# Altium project 3_Interface_Charge_RBF.PrjPCB
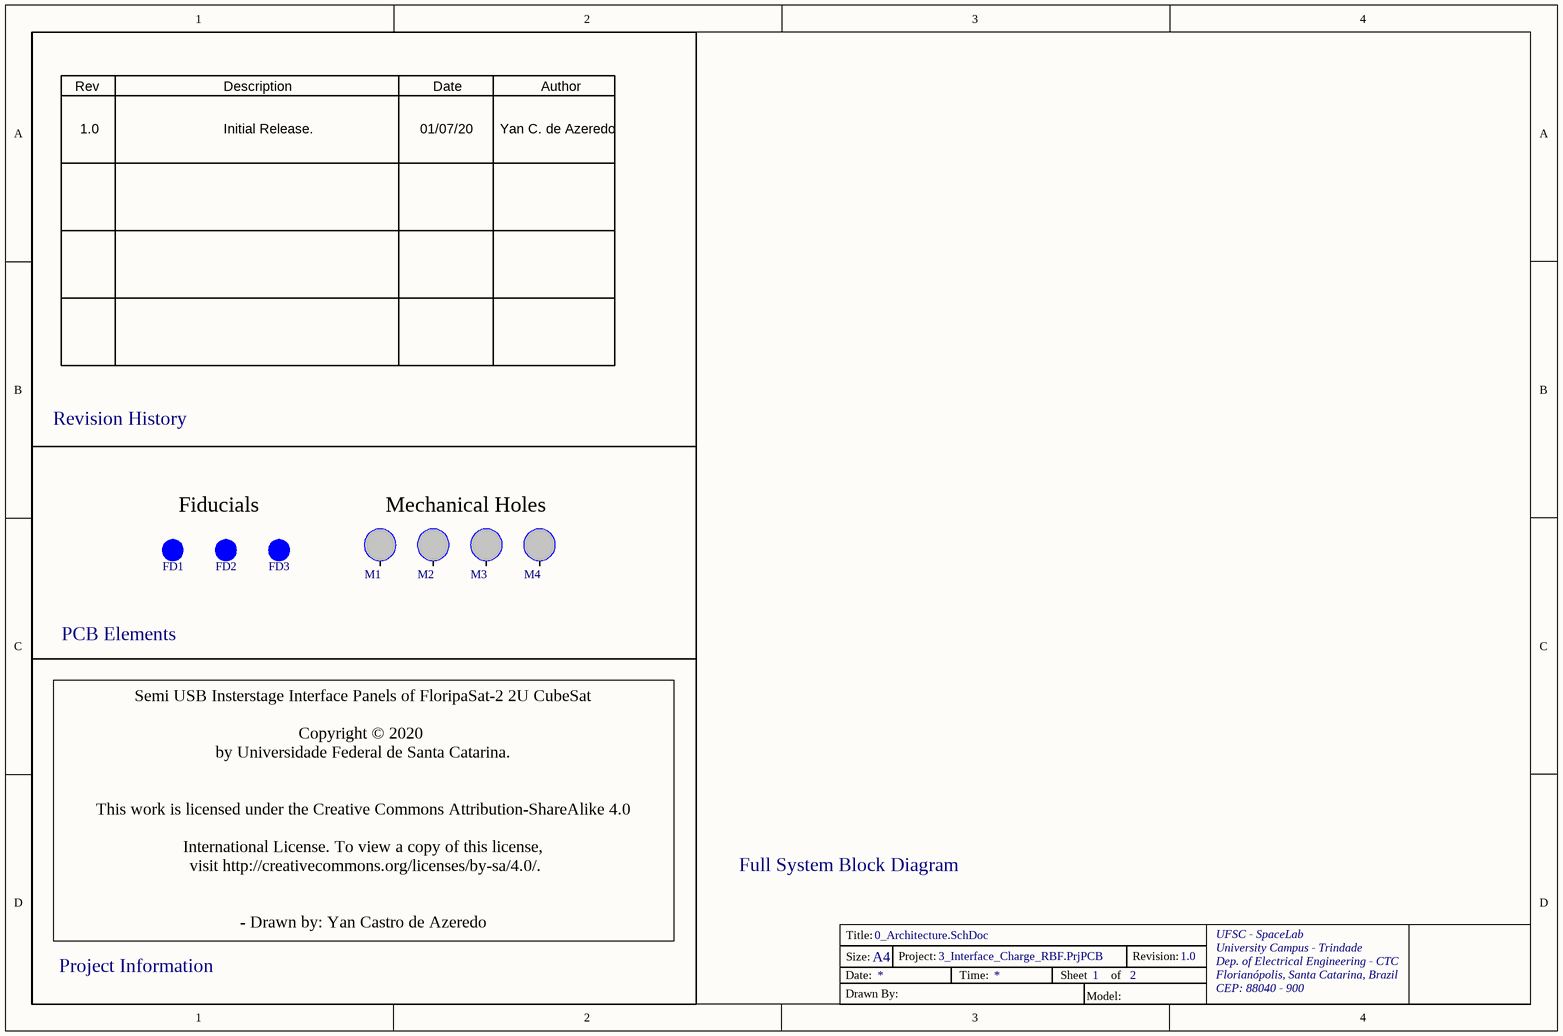
[diagram p0: 0_Architecture.SchDoc]
2 sheets, 11 parts. Net scope: global (net labels, ports and power ports of the same name join across sheets).
Board file: 3_Interface_Charge_RBF.PcbDoc
Sheets:
  0_Architecture.SchDoc
  3_Interface_Charge_RBF.SchDoc

## Sheet 0_Architecture.SchDoc
size A4; Organization: SpaceLab UFSC; Address1: UFSC - SpaceLab; Address2: University Campus - Trindade; Address3: Dep. of Electrical Engineering - CTC; Address4: Florianópolis, Santa Catarina, Brazil; DocumentNumber: 1; Revision: 1.0; SheetNumber: 1; SheetTotal: 2; Address5: CEP: 88040 - 900

### Parts
FD1  Fiducial  [Fiducial 1.3mm]  (value not drawn)  (no BOM)
FD2  Fiducial  [Fiducial 1.3mm]  (value not drawn)  (no BOM)
FD3  Fiducial  [Fiducial 1.3mm]  (value not drawn)  (no BOM)
M1  IB Mechanical Hole  [IB Mechanical Hole]  (value not drawn)  (no BOM)
M2  IB Mechanical Hole  [IB Mechanical Hole]  (value not drawn)  (no BOM)
M3  IB Mechanical Hole  [IB Mechanical Hole]  (value not drawn)  (no BOM)
M4  IB Mechanical Hole  [IB Mechanical Hole]  (value not drawn)  (no BOM)

### Nets

Not connected (* = marked no-connect by the designer): M1 0; M2 0; M3 0; M4 0

### Notes on the sheet
- Rev
- Description
- Date
- Author
- 1.0
- Initial Release.
- 01/07/20
- Yan C. de Azeredo
- Revision History
- Fiducials
- Mechanical Holes
- PCB Elements
- Full System Block Diagram
- Semi USB Insterstage Interface Panels of FloripaSat-2 2U CubeSat
  Copyright © 2020
  by Universidade Federal de Santa Catarina.
  This work is licensed under the Creative Commons Attribution-ShareAlike 4.0
  International License. To view a copy of this license,
  visit http://creativecommons.org/licenses/by-sa/4.0/.
  - Drawn by: Yan Castro de Azeredo
  - Reviewers: Gabriel M. Marcelino and André M. P. Mattos
  - Support: Gabriel M. Marcelino, André M. P. Mattos and Kleber Gouveia
  - Mechanical validation: Edemar Morsch Filho
- Project Information
- Date:
- Title:
- Size:
- A4
- Project:
- Time:
- Sheet
- of
- Revision:
- UFSC - SpaceLab
- University Campus - Trindade
- Dep. of Electrical Engineering - CTC
- Florianópolis, Santa Catarina, Brazil
- CEP: 88040 - 900
- Drawn By:
- Model:

### Library data of the parts
FD1-FD3 = Fiducial: Fiducial for DB board variants
M1-M4 = IB Mechanical Hole: Mechanical Hole for FloripaSat-2 interface boards

## Sheet 3_Interface_Charge_RBF.SchDoc
size A4
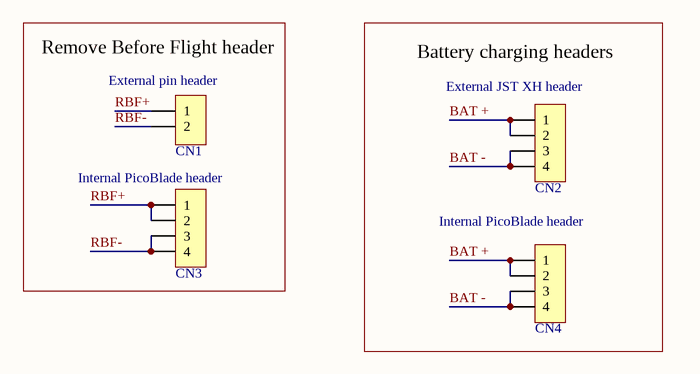
[diagram p1: 3_Interface_Charge_RBF.SchDoc]

### Parts
CN1  M20-9990245  [CONN HEADER VERT 2POS 2.54mm]  (value not drawn)
CN2  B4B-XH-A(LF)(SN)  [B4B-XH-A(LF)(SN)]  (value not drawn)
CN3  0533980471  [PICO BLADE 0533980471]  (value not drawn)
CN4  0533980471  [PICO BLADE 0533980471]  (value not drawn)

### Blocks framed on the sheet
Remove Before Flight header: CN1 CN3
Battery charging headers: CN2 CN4

### Nets
BAT +: CN2.1 CN2.2 CN4.1 CN4.2
BAT -: CN2.3 CN2.4 CN4.3 CN4.4
RBF+: CN1.1 CN3.1 CN3.2
RBF-: CN1.2 CN3.3 CN3.4

### Notes on the sheet
- (near CN1) External pin header
- (near CN2) External JST XH header
- (near CN3) Internal PicoBlade header
- Internal PicoBlade header

### Library data of the parts
CN1 = M20-9990245: M20 HDR, PIN, SIL, VERT, 2W; Manufacturer: Harwin; Number of Contacts: 2; Current Rating: 3A; Contact Resistance: 25mR; Mating Cycles: 300; Voltage Rating (AC): 750V; Insulation Resistance: 10GR; Gender: Male; Connector Type: Male Pin; Voltage: 50V; Pitch: 2.54mm; Supplier 1: Digi-Key; Supplier Part Number 1: 952-2261-ND; Stock 1: 27298; Pricing 1: 1=0.15, 10=0.136, 100=0.0841, 500=0.0696, 1000=0.0609, 5000=0.0522, 10000=0.05075 (USD); Mount: Through Hole; Case/Package: SIL; Weight: 0.25lb; Contact Plating: Gold; Contact Material: Brass,Bronze; Color: Black; Housing Color: Black; Housing Material: Nylon; Min Operating Temperature: -40°C; Max Operating Temperature: 105°C; Number of Rows: 1; Termination: Solder; Max Current Rating: 3A; Number of Poles: 2; Package Quantity: 1000; Packaging: Bag; Number of Positions: 2; Working Voltage: 750V; Orientation: Straight; Current: 3A; Length: 5.08mm; Height: 0.12inch; Lead Pitch: 2.54mm; Width: 0.25inch; Contact Mating Length: 0.24inch; Depth: 2.54mm; Radiation Hardening: No; REACH SVHC: No SVHC; ComponentLink1URL: http://www.farnell.com/datasheets/2368211.pdf?src-supplier=Element14; ComponentLink1Description: http://www.farnell.com/datasheets/2368211.pdf?src-supplier=Element14; ComponentLink2URL: http://uk.rs-online.com/webdocs/1388/0900766b81388728.pdf?src-supplier=RSComponents; ComponentLink2Description: http://uk.rs-online.com/webdocs/1388/0900766b81388728.pdf?src-supplier=RSComponents; ComponentLink3URL: https://cdn.harwin.com/pdfs/Harwin_PC_Connectors_M20.pdf?src-supplier=Digi-Key; ComponentLink3Description: https://cdn.harwin.com/pdfs/Harwin_PC_Connectors_M20.pdf?src-supplier=Digi-Key; ComponentLink4URL: http://www.mouser.com/ds/2/181/Harwin_Product_Catalog_page_206-1134556.pdf?src-supplier=Mouser; ComponentLink4Description: http://www.mouser.com/ds/2/181/Harwin_Product_Catalog_page_206-1134556.pdf?src-supplier=Mouser; Supplier 2: Mouser; Supplier Part Number 2: 855-M20-9990245; Stock 2: 26881; Pricing 2: 1=0.14, 10=0.083, 100=0.069, 1000=0.06, 2000=0.052, 10000=0.05 (USD); Manufacturer Part Number: M20-9990245
CN2 = B4B-XH-A(LF)(SN): JST (JAPAN SOLDERLESS TERMINALS) - B4B-XH-A (LF)(SN) - Wire-To-Board-Steckverbinder, vertikal, 2.5 mm, 4 Kontakt(e), Stiftleiste, Baureihe XH; Current Rating: 3A; Contact Resistance: 20mR; Voltage Rating (AC): 250V; Number of Positions: 4; Insulation Resistance: 1GR; Connector Type: Male Pin; Gender: Male; Pitch: 2.5mm; Wire/Cable Gauge: 22AWG; Supplier 1: Digi-Key; Supplier Part Number 1: 455-2249-ND; Manufacturer: JST; Stock 1: 12513; Pricing 1: 1=0.21, 10=0.194, 100=0.1348, 500=0.11406, 1000=0.09333, 5000=0.08296, 10000=0.07518 (USD); Mount: Through Hole; Contact Material: Brass; Contact Plating: Tin,Copper,Lead; Color: Natural; Housing Color: White; Housing Material: Polyamide; Material: Polyamide; Min Operating Temperature: -25°C; Max Operating Temperature: 85°C; Number of Rows: 1; Max Current Rating: 3A; Package Quantity: 500; Packaging: Bulk; Voltage Rating: 250V; Termination: Press-Fit; Max Voltage Rating (AC): 250V; Max Voltage Rating (DC): 250V; Number of Contacts: 4; Orientation: Straight; Length: 12.4mm; Lead Pitch: 2.5mm; Depth: 5.75mm; REACH SVHC: No SVHC; Lead Free: Lead Free; ComponentLink1URL: https://www.verical.com/server-webapp/html/getDatasheet?partID=455616&src-supplier=Verical; ComponentLink1Description: https://www.verical.com/server-webapp/html/getDatasheet?partID=455616&src-supplier=Verical; ComponentLink2URL: https://www.verical.com/server-webapp/html/getDatasheet?partID=640571&src-supplier=Verical; ComponentLink2Description: https://www.verical.com/server-webapp/html/getDatasheet?partID=640571&src-supplier=Verical; ComponentLink3URL: http://www.jst-mfg.com/product/pdf/eng/eXH.pdf?src-supplier=Digi-Key; ComponentLink3Description: http://www.jst-mfg.com/product/pdf/eng/eXH.pdf?src-supplier=Digi-Key; ComponentLink4URL: http://www.jst-mfg.com/product/pdf/eng/eXH.pdf?src-supplier=Future+Electronics; ComponentLink4Description: http://www.jst-mfg.com/product/pdf/eng/eXH.pdf?src-supplier=Future+Electronics; Manufacturer Part Number: B4B-XH-A(LF)(SN)
CN3 CN4 = 0533980471: CONN HEADER SMD 4POS 1.25MM; Manufacturer: Molex; N of Positions: 4; Pitch: 1.25mm; Mount Type: SMD; Value: 0533980471